# Altium schematic sheet 780-00012-P2, Sch M2 Focus Drive.SchDoc
size B; PageSetup: Record=PageOptions|CenterHorizontal=True|CenterVertical=True|PrintScale=1.09|XCorrection=1.00|YCorrection=1.00|PrintKind=0|BorderSize=5000000|LeftOffset=0|BottomOffset=0|Orientation=2|PaperLength=1000|PaperWidth=1000|Scale=100|PaperSource=7|PrintQuality=-4|MediaType=1|DitherType=10|PaperKind=Tabloid 11 x 17in|PrintScaleMode=1
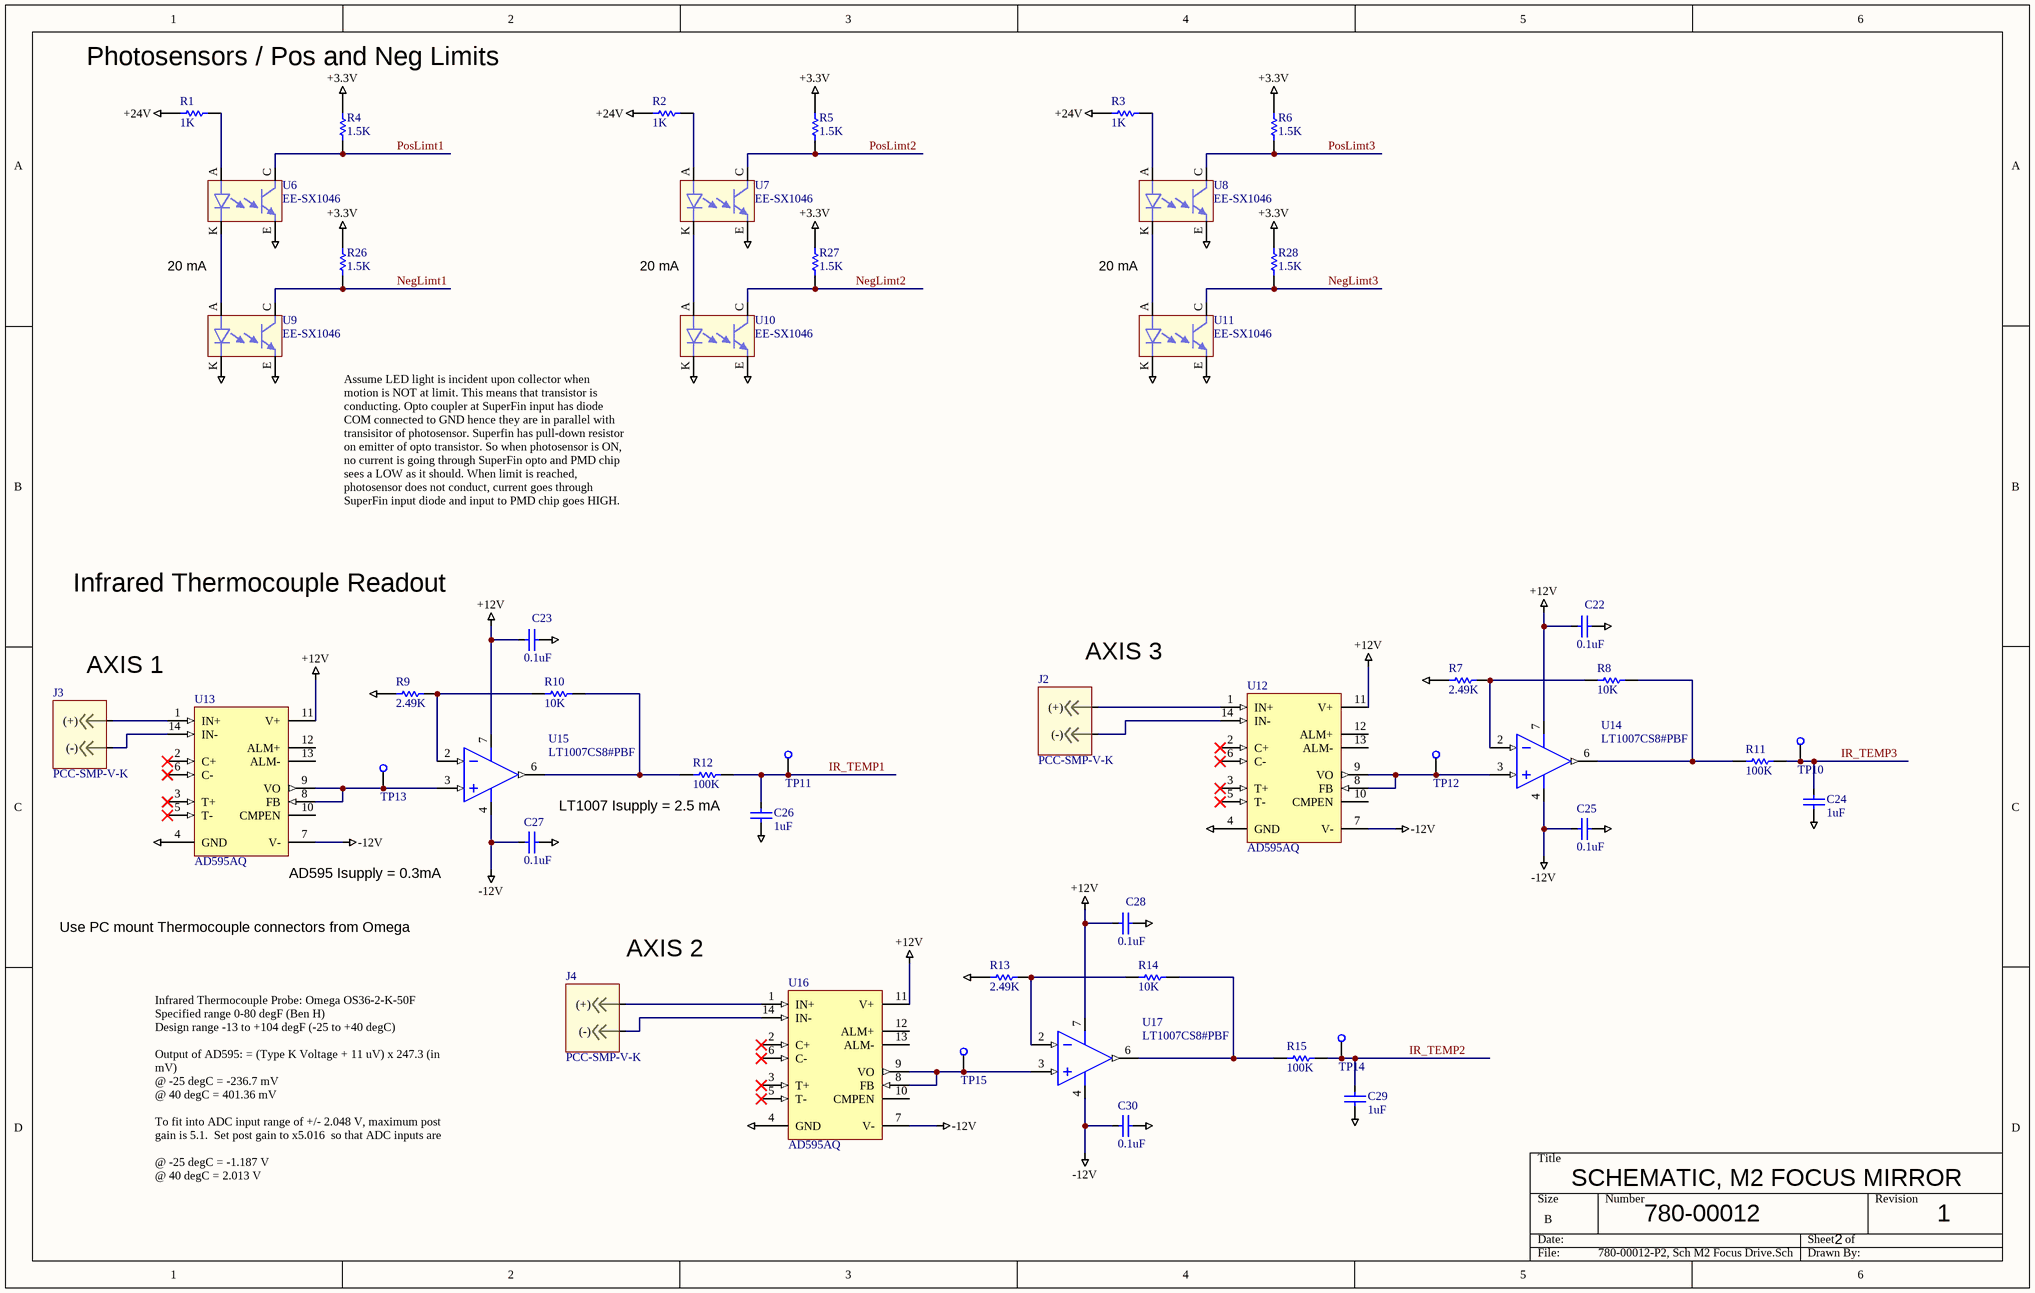
[diagram p0: 780-00012-P2, Sch M2 Focus Drive.SchDoc]

## Parts
C22  value 0.1uF  [SMD_0805]  (hidden comment: Cap SMD)
C23  value 0.1uF  [SMD_0805]  (hidden comment: Cap SMD)
C24  value 1uF  [SMD_0805]  (hidden comment: Cap SMD)
C25  value 0.1uF  [SMD_0805]  (hidden comment: Cap SMD)
C26  value 1uF  [SMD_0805]  (hidden comment: Cap SMD)
C27  value 0.1uF  [SMD_0805]  (hidden comment: Cap SMD)
C28  value 0.1uF  [SMD_0805]  (hidden comment: Cap SMD)
C29  value 1uF  [SMD_0805]  (hidden comment: Cap SMD)
C30  value 0.1uF  [SMD_0805]  (hidden comment: Cap SMD)
J2  PCC-SMP-V-K  [THERMOCOUPLE]
J3  PCC-SMP-V-K  [THERMOCOUPLE]
J4  PCC-SMP-V-K  [THERMOCOUPLE]
R1  value 1K  [SMD_0805]  (hidden comment: Res 0805)
R2  value 1K  [SMD_0805]  (hidden comment: Res 0805)
R3  value 1K  [SMD_0805]  (hidden comment: Res 0805)
R4  value 1.5K  [SMD_0805]  (hidden comment: Res 0805)
R5  value 1.5K  [SMD_0805]  (hidden comment: Res 0805)
R6  value 1.5K  [SMD_0805]  (hidden comment: Res 0805)
R7  value 2.49K  [SMD_0805]  (hidden comment: Res 0805)
R8  value 10K  [SMD_0805]  (hidden comment: Res 0805)
R9  value 2.49K  [SMD_0805]  (hidden comment: Res 0805)
R10  value 10K  [SMD_0805]  (hidden comment: Res 0805)
R11  value 100K  [SMD_0805]  (hidden comment: Res 0805)
R12  value 100K  [SMD_0805]  (hidden comment: Res 0805)
R13  value 2.49K  [SMD_0805]  (hidden comment: Res 0805)
R14  value 10K  [SMD_0805]  (hidden comment: Res 0805)
R15  value 100K  [SMD_0805]  (hidden comment: Res 0805)
R26  value 1.5K  [SMD_0805]  (hidden comment: Res 0805)
R27  value 1.5K  [SMD_0805]  (hidden comment: Res 0805)
R28  value 1.5K  [SMD_0805]  (hidden comment: Res 0805)
TP10  Test Point SMD  [SMD_TEST POINT]  (value not drawn)
TP11  Test Point SMD  [SMD_TEST POINT]  (value not drawn)
TP12  Test Point SMD  [SMD_TEST POINT]  (value not drawn)
TP13  Test Point SMD  [SMD_TEST POINT]  (value not drawn)
TP14  Test Point SMD  [SMD_TEST POINT]  (value not drawn)
TP15  Test Point SMD  [SMD_TEST POINT]  (value not drawn)
U6  EE-SX1046  [Photo-sensor]
U7  EE-SX1046  [Photo-sensor]
U8  EE-SX1046  [Photo-sensor]
U9  EE-SX1046  [Photo-sensor]
U10  EE-SX1046  [Photo-sensor]
U11  EE-SX1046  [Photo-sensor]
U12  AD595AQ  [Q-14_A]
U13  AD595AQ  [Q-14_A]
U14  LT1007CS8#PBF  [S8_M]
U15  LT1007CS8#PBF  [S8_M]
U16  AD595AQ  [Q-14_A]
U17  LT1007CS8#PBF  [S8_M]

## Nets
+3.3V: R4.2 R5.2 R6.2 R26.2 R27.2 R28.2
+12V: C22.2 C23.2 C28.2 U12.11(V+) U13.11(V+) U14.7(V+) U15.7(V+) U16.11(V+) U17.7(V+)
+24V: R1.2 R2.2 R3.2
-12V: C25.2 C27.2 C30.2 U12.7(V-) U13.7(V-) U14.4(V-) U15.4(V-) U16.7(V-) U17.4(V-)
GND: C22.1 C23.1 C24.1 C25.1 C26.1 C27.1 C28.1 C29.1 C30.1 R7.1 R9.1 R13.1 U6.E(emitter) U7.E(emitter) U8.E(emitter) U9.E(emitter) U9.K(cathode) U10.E(emitter) U10.K(cathode) U11.E(emitter) U11.K(cathode) U12.4(GND) U13.4(GND) U16.4(GND)
IR_TEMP1: C26.2 R12.2 TP11.1(TP)
IR_TEMP2: C29.2 R15.2 TP14.1(TP)
IR_TEMP3: C24.2 R11.2 TP10.1(TP)
NegLimt1: R26.1 U9.C(collector)
NegLimt2: R27.1 U10.C(collector)
NegLimt3: R28.1 U11.C(collector)
PosLimt1: R4.1 U6.C(collector)
PosLimt2: R5.1 U7.C(collector)
PosLimt3: R6.1 U8.C(collector)
NetJ2_1: J2.1((+)) U12.1(IN+)
NetJ2_2: J2.2((-)) U12.14(IN-)
NetJ3_1: J3.1((+)) U13.1(IN+)
NetJ3_2: J3.2((-)) U13.14(IN-)
NetJ4_1: J4.1((+)) U16.1(IN+)
NetJ4_2: J4.2((-)) U16.14(IN-)
NetR1_1: R1.1 U6.A(anode)
NetR2_1: R2.1 U7.A(anode)
NetR3_1: R3.1 U8.A(anode)
NetR7_2: R7.2 R8.1 U14.2(IN-)
NetR8_2: R8.2 R11.1 U14.6(OUT)
NetR9_2: R9.2 R10.1 U15.2(IN-)
NetR10_2: R10.2 R12.1 U15.6(OUT)
NetR13_2: R13.2 R14.1 U17.2(IN-)
NetR14_2: R14.2 R15.1 U17.6(OUT)
NetTP12_1: TP12.1(TP) U12.8(FB) U12.9(VO) U14.3(IN+)
NetTP13_1: TP13.1(TP) U13.8(FB) U13.9(VO) U15.3(IN+)
NetTP15_1: TP15.1(TP) U16.8(FB) U16.9(VO) U17.3(IN+)
NetU6_K: U6.K(cathode) U9.A(anode)
NetU7_K: U7.K(cathode) U10.A(anode)
NetU8_K: U8.K(cathode) U11.A(anode)

Not connected (* = marked no-connect by the designer): U12 2(C+)* 3(T+)* 5(T-)* 6(C-)* 10(CMPEN) 12(ALM+) 13(ALM-); U13 2(C+)* 3(T+)* 5(T-)* 6(C-)* 10(CMPEN) 12(ALM+) 13(ALM-); U14 1(VOSTRIM) 5(NC) 8(VOSTRIM); U15 1(VOSTRIM) 5(NC) 8(VOSTRIM); U16 2(C+)* 3(T+)* 5(T-)* 6(C-)* 10(CMPEN) 12(ALM+) 13(ALM-); U17 1(VOSTRIM) 5(NC) 8(VOSTRIM)

## Notes on the sheet
- Photosensors / Pos and Neg Limits
- 20 mA
- Assume LED light is incident upon collector when motion is NOT at limit. This means that transistor is conducting. Opto coupler at SuperFin input has diode COM connected to GND hence they are in parallel with transisitor of photosensor. Superfin has pull-down resistor on emitter of opto transistor. So when photosensor is ON, no current is going through SuperFin opto and PMD chip sees a LOW as it should. When limit is reached, photosensor does not conduct, current goes through SuperFin input diode and input to PMD chip goes HIGH.
- Infrared Thermocouple Readout
- AXIS 1
- (near J2) AXIS 3
- LT1007 Isupply = 2.5 mA
- (near U13) AD595 Isupply = 0.3mA
- Use PC mount Thermocouple connectors from Omega
- (near J4) AXIS 2
- Infrared Thermocouple Probe: Omega OS36-2-K-50F
  Specified range 0-80 degF (Ben H)
  Design range -13 to +104 degF (-25 to +40 degC)
  Output of AD595: = (Type K Voltage + 11 uV) x 247.3 (in mV)
  @ -25 degC = -236.7 mV
  @ 40 degC = 401.36 mV
  To fit into ADC input range of +/- 2.048 V, maximum post gain is 5.1.  Set post gain to x5.016  so that ADC inputs are
  @ -25 degC = -1.187 V
  @ 40 degC = 2.013 V
- SCHEMATIC, M2 FOCUS MIRROR
- 780-00012
- 2
- 1

## Library data of the parts
C22 C23 C25 C27 C28 C30 = Cap SMD: Capacitor; LCO p/n: 120-00002
C24 C26 C29 = Cap SMD: Capacitor; LCO p/n: 120-00006
J2-J4 = Thermocouple Connector: T/C Conn PCB mount vertical; LCO p/n: 125-00042
R1-R3 = Res SMD: Resistor 0805; Manufacturer: Vishay/Dale; Manuf p/n: CRCW08051KFKEA; Vendor: DIGIKEY; Vendor p/n: 541-1KCCT-ND; Vendor Mult.: 10; LCO p/n: 181-01001; COST: 0.09
R4-R6 R26-R28 = Res SMD: Resistor 0805; Manufacturer: Vishay/Dale; Manuf p/n: CRCW08051.5KFKEA; Vendor: DIGIKEY; Vendor p/n: 541-1.5KCCT-ND; Vendor Mult.: 10; LCO p/n: 181-01501; COST: 0.09
R7 R9 R13 = Res SMD: Resistor 0805; Manufacturer: Vishay/Dale; Manuf p/n: CRCW08052.49KFKEA; Vendor: DIGIKEY; Vendor p/n: 541-2.49KCCT-ND; Vendor Mult.: 10; LCO p/n: 181-02491; COST: 0.09
R8 R10 R14 = Res SMD: Resistor 0805; Manufacturer: Vishay/Dale; Manuf p/n: CRCW080510KFKEA; Vendor: DIGIKEY; Vendor p/n: 541-10KCCT-ND; Vendor Mult.: 10; LCO p/n: 181-01002; COST: 0.09
R11 R12 R15 = Res SMD: Resistor 0805; Manufacturer: Vishay/Dale; Manuf p/n: CRCW0805100KFKEA; Vendor: DIGIKEY; Vendor p/n: 541-100KCCT-ND; Vendor Mult.: 10; LCO p/n: 181-01003; COST: 0.09
TP10-TP15 = Test Point SMD: SMD loop test point; LCO p/n: 160-00001; VALUE: Test Point SMD
U6-U11 = Photo-sensor: Omron EE-SX1046; LCO p/n: 135-00001
U12 U13 U16 = AD595AQ: Monolithic Thermocouple Amplifier with Cold Junction Compensation; Manufacturer: Analog Devices; LCO p/n: 150-00066; Vendor: Digi-Key; Vendor Mult.: 1; Vendor p/n: AD595AQ-ND; COST: 12.35; Manuf p/n: AD595AQ; VALUE: AD595AQ
U14 U15 U17 = LT1007CS8#PBF: Low Noise BJT input opamp; Manufacturer: Linear Tech; LCO p/n: 150-00067; VALUE: LT1007; Vendor: DigiKey; Vendor Mult.: 1; Vendor p/n: LT1007CS8#PBF-ND; COST: 4.13; Manuf p/n: LT1007CS8#PBF